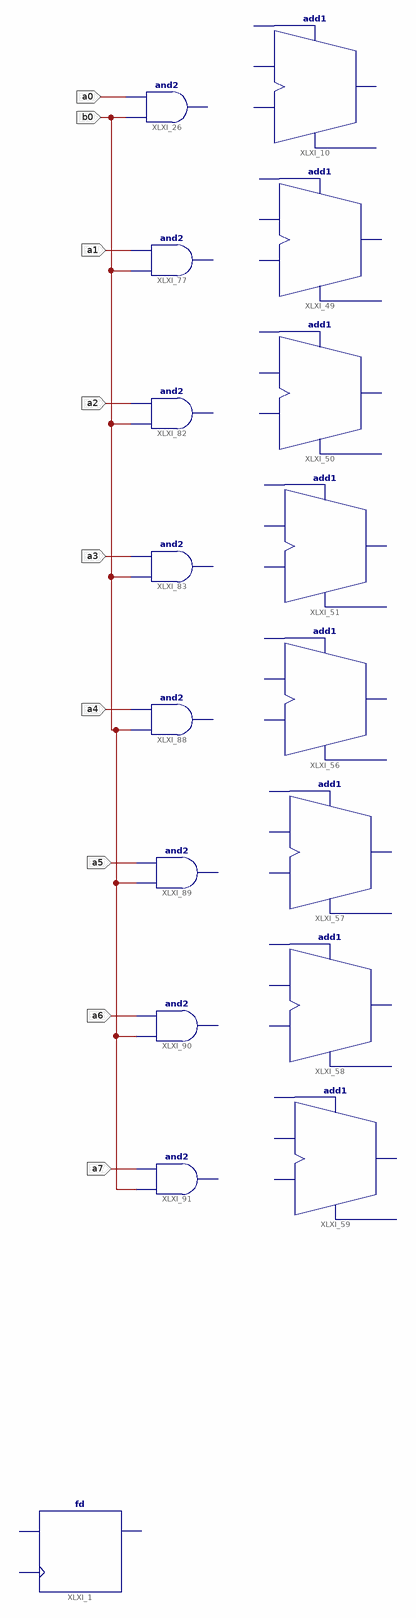
[diagram p0: schematic sheet 1]
// Xilinx ISE schematic scheme_very_big.sch (xc9500xl) as structural Verilog: 17 symbols, 9 ports
module scheme_very_big (
  input  a0,
  input  a1,
  input  a2,
  input  a3,
  input  a4,
  input  a5,
  input  a6,
  input  a7,
  input  b0
);

  fd XLXI_1 ();  // open: C, D, Q
  // and2 XLXI_26 has open pins: I0=b0, I1=a0, O=open
  add1 XLXI_10 ();  // open: A0, B0, CI, CO, S0
  add1 XLXI_49 ();  // open: A0, B0, CI, CO, S0
  add1 XLXI_50 ();  // open: A0, B0, CI, CO, S0
  add1 XLXI_51 ();  // open: A0, B0, CI, CO, S0
  add1 XLXI_56 ();  // open: A0, B0, CI, CO, S0
  add1 XLXI_57 ();  // open: A0, B0, CI, CO, S0
  add1 XLXI_58 ();  // open: A0, B0, CI, CO, S0
  add1 XLXI_59 ();  // open: A0, B0, CI, CO, S0
  // and2 XLXI_77 has open pins: I0=b0, I1=a1, O=open
  // and2 XLXI_82 has open pins: I0=b0, I1=a2, O=open
  // and2 XLXI_83 has open pins: I0=b0, I1=a3, O=open
  // and2 XLXI_88 has open pins: I0=b0, I1=a4, O=open
  // and2 XLXI_89 has open pins: I0=b0, I1=a5, O=open
  // and2 XLXI_90 has open pins: I0=b0, I1=a6, O=open
  // and2 XLXI_91 has open pins: I0=b0, I1=a7, O=open
endmodule
